# Altium schematic sheet S2_WirelessAudio_CC8530.SchDoc
size 431 x 279 mm; Revision: 1-0; SheetNumber: 3; SheetTotal: 4; CustomerName: PLASTIMOLD; .GlobalProjectCustomer: PLASTIMOLD; ProjectName: Chairspeaker TI Receiver
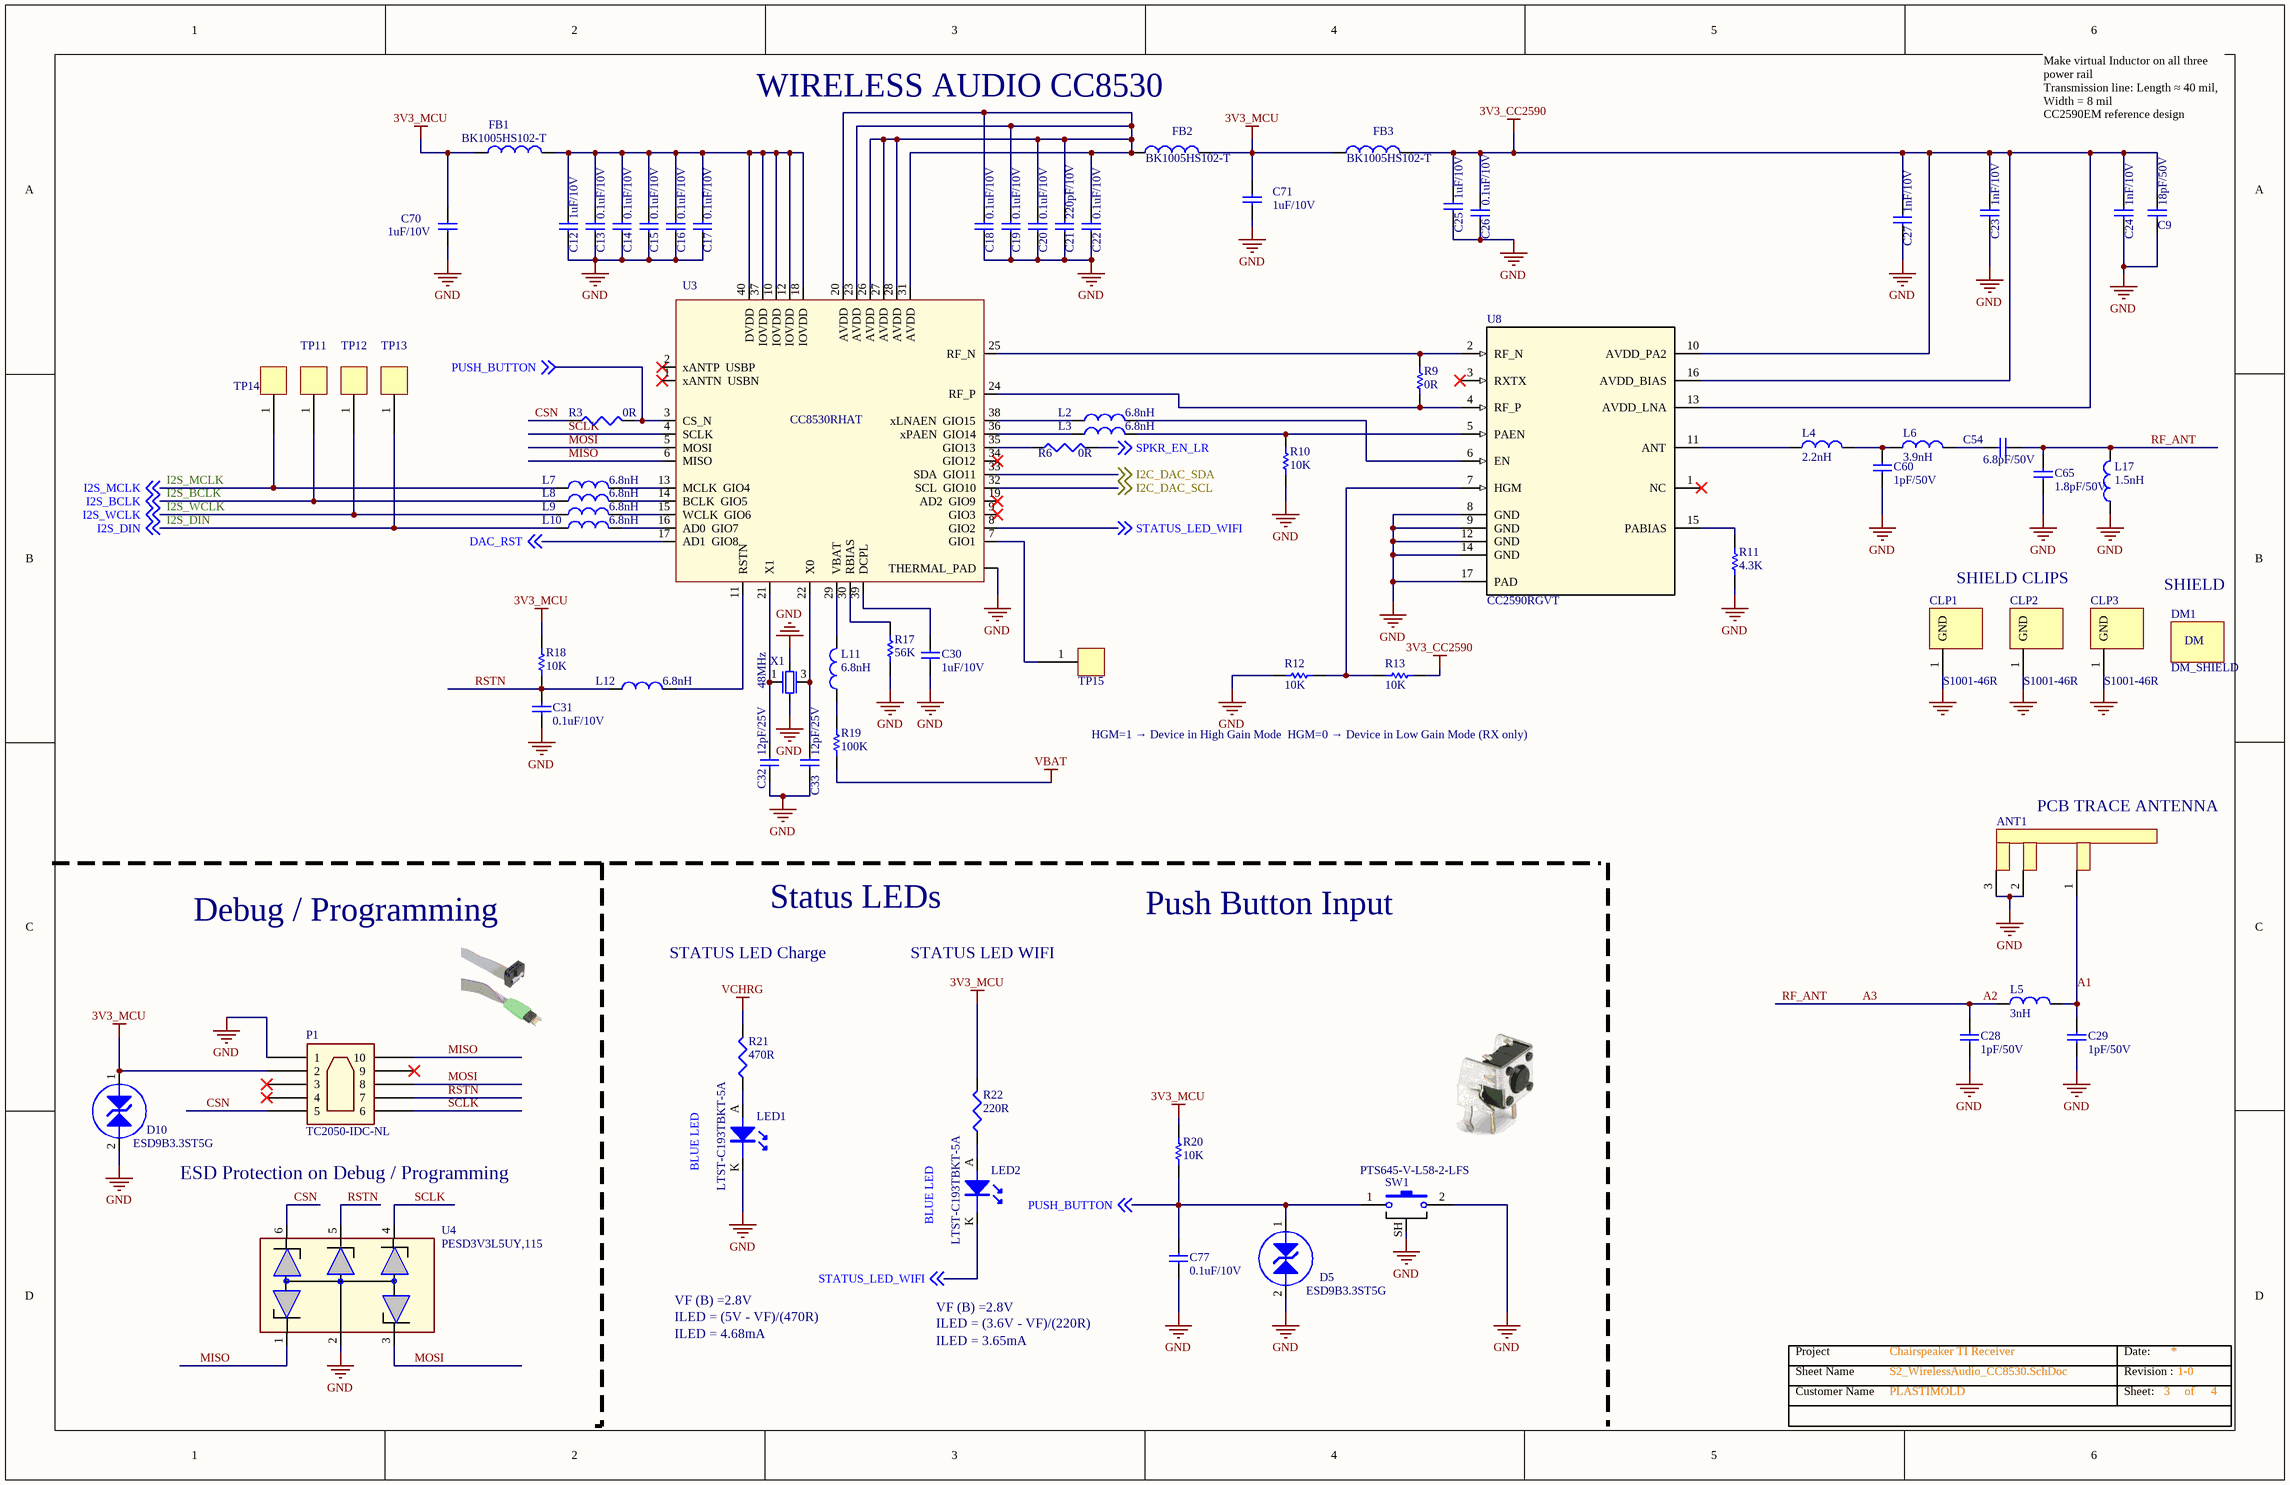
[diagram p0: S2_WirelessAudio_CC8530.SchDoc]

## Parts
ANT1  INVERTED F ANTENNA  [ANT]  (value not drawn)  (no BOM)
C9  18pF/50V  [CAP_0402_(M1005)]
C12  1uF/10V  [CAP_0402_(M1005)]
C13  0.1uF/10V  [CAP_0402_(M1005)]
C14  0.1uF/10V  [CAP_0402_(M1005)]
C15  0.1uF/10V  [CAP_0402_(M1005)]
C16  0.1uF/10V  [CAP_0402_(M1005)]
C17  0.1uF/10V  [CAP_0402_(M1005)]
C18  0.1uF/10V  [CAP_0402_(M1005)]
C19  0.1uF/10V  [CAP_0402_(M1005)]
C20  0.1uF/10V  [CAP_0402_(M1005)]
C21  220pF/10V  [CAP_0402_(M1005)]
C22  0.1uF/10V  [CAP_0402_(M1005)]
C23  1nF/10V  [CAP_0402_(M1005)]
C24  1nF/10V  [CAP_0402_(M1005)]
C25  1uF/10V  [CAP_0402_(M1005)]
C26  0.1uF/10V  [CAP_0402_(M1005)]
C27  1nF/10V  [CAP_0402_(M1005)]
C28  1pF/50V  [CAP_0402_(M1005)]
C29  1pF/50V  [CAP_0402_(M1005)]
C30  1uF/10V  [CAP_0402_(M1005)]
C31  0.1uF/10V  [CAP_0402_(M1005)]
C32  12pF/25V  [CAP_0402_(M1005)]
C33  12pF/25V  [CAP_0402_(M1005)]
C54  6.8pF/50V  [CAP_0402_(M1005)]
C60  1pF/50V  [CAP_0402_(M1005)]
C65  1.8pF/50V  [CAP_0402_(M1005)]
C70  1uF/10V  [CAP_0402_(M1005)]
C71  1uF/10V  [CAP_0402_(M1005)]
C77  0.1uF/10V  [CAP_0402_(M1005)]
CLP1  S1001-46R  [S1001-46R]
CLP2  S1001-46R  [S1001-46R]
CLP3  S1001-46R  [S1001-46R]
D5  ESD9B3.3ST5G  [SOD-923-BI-DIRECTIONAL]
D10  ESD9B3.3ST5G  [SOD-923-BI-DIRECTIONAL]
DM1  DM_SHIELD
FB1  BK1005HS102-T  [IND_0402_(M1005)]
FB2  BK1005HS102-T  [IND_0402_(M1005)]
FB3  BK1005HS102-T  [IND_0402_(M1005)]
L2  6.8nH  [IND_0402_(M1005)]
L3  6.8nH  [IND_0402_(M1005)]
L4  2.2nH  [IND_0402_(M1005)]
L5  3nH  [IND_0402_(M1005)]
L6  3.9nH  [IND_0402_(M1005)]
L7  6.8nH  [IND_0402_(M1005)]
L8  6.8nH  [IND_0402_(M1005)]
L9  6.8nH  [IND_0402_(M1005)]
L10  6.8nH  [IND_0402_(M1005)]
L11  6.8nH  [IND_0402_(M1005)]
L12  6.8nH  [IND_0402_(M1005)]
L17  1.5nH  [IND_0402_(M1005)]
LED1  LTST-C193TBKT-5A  [LED0603_TM]
LED2  LTST-C193TBKT-5A  [LED0603_TM]
P1  TC2050-IDC-NL  [TC2050-IDC-NL]
R3  0R  [RES_0402_(M1005)]
R6  0R  [RES_0402_(M1005)]
R9  0R  [RES_0402_(M1005)]
R10  10K  [RES_0402_(M1005)]
R11  4.3K  [RES_0402_(M1005)]
R12  10K  [RES_0402_(M1005)]
R13  10K  [RES_0402_(M1005)]
R17  56K  [IND_0402_(M1005)]
R18  10K  [RES_0402_(M1005)]
R19  100K  [RES_0402_(M1005)]
R20  10K  [RES_0402_(M1005)]
R21  470R  [RES_0402_(M1005)]
R22  220R  [RES_0402_(M1005)]
SW1  PTS645-V-L58-2-LFS  [SWITCH-PTS645-VL]
TP11  TP  [TestP SM 30MIL ROUND]  (value not drawn)  (no BOM)
TP12  TP  [TestP SM 30MIL ROUND]  (value not drawn)  (no BOM)
TP13  TP  [TestP SM 30MIL ROUND]  (value not drawn)  (no BOM)
TP14  TP  [TestP SM 30MIL ROUND]  (value not drawn)  (no BOM)
TP15  TP  [TestP SM 30MIL ROUND]  (value not drawn)  (no BOM)
U3  CC8530RHAT  [VFQFN40]
U4  PESD3V3L5UY,115  [SOT-363]
U8  CC2590RGVT  [QFN65P400X400X100-17N-D]
X1  48MHz  [ECX-2236B]

## Nets
3V3_CC2590: C9.2 C23.2 C24.2 C25.2 C26.2 C27.2 FB3.2 R13.2 U8.10(AVDD_PA2) U8.13(AVDD_LNA) U8.16(AVDD_BIAS)
3V3_MCU: C70.2 C71.2 D10.1 FB1.1 FB2.2 FB3.1 P1.2 R18.1 R20.1 R22.2
GND: ANT1.2 ANT1.3 C9.1 C12.1 C13.1 C14.1 C15.1 C16.1 C17.1 C18.1 C19.1 C20.1 C21.1 C22.1 C23.1 C24.1 C25.1 C26.1 C27.1 C28.2 C29.2 C30.1 C31.1 C32.2 C33.2 C60.2 C65.1 C70.1 C71.1 C77.2 CLP1.1(GND) CLP2.1(GND) CLP3.1(GND) D5.2 D10.2 L17.1 LED1.K P1.1 R10.2 R11.1 R12.1 R17.2 SW1.2 SW1.SH U3.GND(THERMAL_PAD) U4.2(GND) U8.8(GND) U8.9(GND) U8.12(GND) U8.14(GND) U8.17(PAD) X1.2 X1.4
VBAT: R19.2
VCHRG: R21.2
A1: ANT1.1 C29.1 L5.2
A2: C28.1 C54.2 C65.2 L5.1 L17.2  [also labelled A3, RF_ANT]
CSN: P1.5 R3.1 U4.6(I/O4)
DAC_RST: U3.17(AD1__GIO8) ; off-sheet DAC_RST
I2C_DAC_SCL: U3.32(SCL__GIO10) ; off-sheet I2C_DAC_SCL
I2C_DAC_SDA: U3.33(SDA__GIO11) ; off-sheet I2C_DAC_SDA
I2S_BCLK: L8.1 TP11.1 ; off-sheet I2S_BCLK
I2S_DIN: L10.1 TP13.1 ; off-sheet I2S_DIN
I2S_MCLK: L7.1 TP14.1 ; off-sheet I2S_MCLK
I2S_WCLK: L9.1 TP12.1 ; off-sheet I2S_WCLK
MISO: P1.10 U3.6(MISO) U4.1(I/O1)
MOSI: P1.8 U3.5(MOSI) U4.3(I/O2)
PUSH_BUTTON: C77.1 D5.1 R3.2 R20.2 SW1.1 U3.3(CS_N) ; off-sheet PUSH_BUTTON
RSTN: C31.2 L12.1 P1.7 R18.2 U4.5(VDD)
SCLK: P1.6 U3.4(SCLK) U4.4(I/O3)
SPKR_EN_LR: R6.2 ; off-sheet SPKR_EN_LR
STATUS_LED_WIFI: LED2.K U3.8(GIO2) ; off-sheet STATUS_LED_WIFI
NetC12_2: C12.2 C13.2 C14.2 C15.2 C16.2 C17.2 FB1.2 U3.10(IOVDD) U3.12(IOVDD) U3.18(IOVDD) U3.37(IOVDD) U3.40(DVDD)
NetC18_2: C18.2 C19.2 C20.2 C21.2 C22.2 FB2.1 U3.20(AVDD) U3.23(AVDD) U3.26(AVDD) U3.27(AVDD) U3.28(AVDD) U3.31(AVDD)
NetC30_2: C30.2 U3.39(DCPL)
NetC32_1: C32.1 U3.21(X1) X1.1
NetC33_1: C33.1 U3.22(X0) X1.3
NetC54_1: C54.1 L6.2
NetC60_1: C60.1 L4.2 L6.1
NetL2_1: L2.1 U3.38(xLNAEN__GIO15)
NetL2_2: L2.2 U8.6(EN)
NetL3_1: L3.1 U3.36(xPAEN__GIO14)
NetL3_2: L3.2 R10.1 U8.5(PAEN)
NetL4_1: L4.1 U8.11(ANT)
NetL7_2: L7.2 U3.13(MCLK__GIO4)
NetL8_2: L8.2 U3.14(BCLK__GIO5)
NetL9_2: L9.2 U3.15(WCLK__GIO6)
NetL10_2: L10.2 U3.16(AD0__GIO7)
NetL11_1: L11.1 R19.1
NetL11_2: L11.2 U3.29(VBAT)
NetL12_2: L12.2 U3.11(RSTN)
NetLED1_A: LED1.A R21.1
NetLED2_A: LED2.A R22.1
NetR6_1: R6.1 U3.35(GIO13)
NetR9_1: R9.1 U3.24(RF_P) U8.4(RF_P)
NetR9_2: R9.2 U3.25(RF_N) U8.2(RF_N)
NetR11_2: R11.2 U8.15(PABIAS)
NetR12_2: R12.2 R13.1 U8.7(HGM)
NetR17_1: R17.1 U3.30(RBIAS)
NetTP15_1: TP15.1 U3.7(GIO1)

Not connected (* = marked no-connect by the designer): P1 3* 4* 9*; U3 1(xANTN__USBN)* 2(xANTP__USBP)* 9(GIO3)* 19(AD2__GIO9)* 34(GIO12)*; U8 1(NC)* 3(RXTX)*

## Notes on the sheet
- WIRELESS AUDIO CC8530
- Make virtual Inductor on all three power rail
  Transmission line: Length ≈ 40 mil, Width = 8 mil
  CC2590EM reference design
- SHIELD CLIPS
- SHIELD
- HGM=1 → Device in High Gain Mode  HGM=0 → Device in Low Gain Mode (RX only)
- PCB TRACE ANTENNA
- Debug / Programming
- STATUS LED Charge
- Status LEDs
- STATUS LED WIFI
- Push Button Input
- BLUE LED
- ESD Protection on Debug / Programming
- VF (B) =2.8V
- ILED = 4.68mA
- ILED = (5V - VF)/(470R)
- ILED = 3.65mA
- ILED = (3.6V - VF)/(220R)
- Sheet Name
- Project
- Date:
- Revision :
- Customer Name
- Sheet:
- of
- (in symbol DM_SHIELD) DM

## Library data of the parts
ANT1 = INVERTED_F: =Description1; Manufacturer 1: NA; Cross Allowed: NO; Description1: Inverted F Antenna; Value: Inverted F Antenna; Manufacturer Part Number 1: NA
C9 = CAP: =Description1; Manufacturer 1: Samsung Electro-Mechanics; Manufacturer Part Number 1: CL05C180JB5NNNC; Description1: CAP CER 18PF 50V C0G/NP0 0402; Cross Allowed: YES; Value: 18pF/50V
C12 C25 C30 C70 C71 = CAP: =Description1; Manufacturer 1: Murata Electronics; Manufacturer Part Number 1: GRM155R61A105KE15D; Description1: CAP CER 1UF 10V X5R 0402; Cross Allowed: YES; Value: 1uF/10V
C13-C20 C22 C26 C31 C77 = CAP_1: =Description1; Manufacturer 1: Yageo; Manufacturer Part Number 1: CC0402KRX7R6BB104; Description1: CAP CER 0.1UF 10V X7R 0402; Cross Allowed: YES; Value: 0.1uF/10V
C21 = CAP_1: =Description1; Manufacturer 1: Würth Elektronik; Manufacturer Part Number 1: 885012005015; Description1: CAP CER 220PF 10V C0G/NP0 0402; Cross Allowed: YES; Value: 220pF/10V
C23 C24 C27 = CAP_1: =Description1; Manufacturer 1: Yageo; Manufacturer Part Number 1: CC0402KRX7R6BB103; Description1: CAP CER 10000PF 10V X7R 0402; Cross Allowed: YES; Value: 1nF/10V
C28 C29 C60 = CAP: =Description1; Manufacturer 1: AVX Corporation; Manufacturer Part Number 1: 04025A1R0KAT2A; Description1: CAP CER 1PF 50V NP0 0402; Cross Allowed: YES; Value: 1pF/50V
C32 C33 = CAP_1: =Description1; Manufacturer 1: Walsin Technology Corporation; Manufacturer Part Number 1: 0402N120J250CT; Description1: CAP CER 12PF 25V C0G/NP0 0402; Cross Allowed: YES; Value: 12pF/25V
C54 = CAP: =Description1; Manufacturer 1: Samsung Electro-Mechanics; Manufacturer Part Number 1: 04025A6R8KAT2A; Description1: CAP CER 6.8PF 50V C0G/NP0 0402; Cross Allowed: YES; Value: 6.8pF/50V
C65 = CAP: =Description1; Manufacturer 1: Samsung Electro-Mechanics; Manufacturer Part Number 1: CL05C1R8BB5NNNC; Description1: CAP CER 1.8PF 50V C0G/NP0 0402; Cross Allowed: YES; Value: 1.8pF/50V
CLP1-CLP3 = S2711-46R: =Description1; Manufacturer 1: Harwin Inc.; Description1: RFI SHIELD CLIP MICRO TIN SMD; Cross Allowed: NO; Manufacturer Part Number 1: S1001-46R; Value: S1001-46R
D5 D10 = TVS-DIODE: TVS DIODE 5V 15.5V 0402; Manufacturer 1: ON Semiconductor; Description1: TVS DIODE 3.3V 11.5V SOD923; Cross Allowed: YES; Manufacturer Part Number 1: ESD9B3.3ST5G; VALUE: ESD9B3.3ST5G
DM1 = DM_SHIELD: =Description1; Description1: TBD; Value: DM-SHIELD; Cross Allowed: NO; Manufacturer 1: TBD; Manufacturer Part Number 1: TBD
FB1-FB3 = FERRITE BEAD: =Description1; Manufacturer 1: Taiyo Yuden; Description1: FERRITE BEAD 1 KOHM 0402 1LN; Cross Allowed: YES; Manufacturer Part Number 1: BK1005HS102-T; Value: BK1005HS102-T
L2 L3 L7-L12 = IND: =Description1; Manufacturer Part Number 1: HK10056N8J-T; Manufacturer 1: Taiyo Yuden; Description1: FIXED IND 6.8NH 430MA 250 MOHM; Cross Allowed: YES; Value: 6.8nH
L4 = IND: =Description1; Manufacturer Part Number 1: LQG15HS2N2S02D; Manufacturer 1: Murata Electronics; Description1: FIXED IND 2.2NH 900MA 120MOHM SM; Cross Allowed: YES; Value: 2.2nH
L5 = IND: =Description1; Manufacturer Part Number 1: LQG15HS3N0S02D; Manufacturer 1: Murata Electronics; Description1: FIXED IND 3NH 800MA 125 MOHM SMD; Cross Allowed: YES; Value: 3nH
L6 = IND: =Description1; Manufacturer Part Number 1: LQG15HS3N9S02D; Manufacturer 1: Murata Electronics; Description1: FIXED IND 3.9NH 750MA 180MOHM SM; Cross Allowed: YES; Value: 3.9nH
L17 = IND: =Description1; Manufacturer Part Number 1: LQG15HS1N5S02D; Manufacturer 1: Murata Electronics; Description1: FIXED IND 1.5NH 1A 100 MOHM SMD; Cross Allowed: YES; Value: 1.5nH
LED1 LED2 = LED: LED GREEN 0603 SMD; Manufacturer 1: LITEON; Description1: LED BLUE CLEAR CHIP 0603 SMD; Cross Allowed: YES; Manufacturer Part Number 1: LTST-C193TBKT-5A; VALUE: LTST-C193TBKT-5A
P1 = TC2050-IDC: =Description1; Manufacturer 1: TAG-CONNECT; Description1: PROGRAMMING CABLE PLUG-OF-NAILS; Cross Allowed: NO; Manufacturer Part Number 1: TC2050-IDC-NL; VALUE: TC2050-IDC-NL
R3 R6 = RES_0R: =Description1; Manufacturer 1: Panasonic Electronic Components; Manufacturer Part Number 1: ERJ-2GE0R00X; Description1: RES 0R JUMPER 1/10W 0402; Cross Allowed: YES; Value: 0R
R9 = RC1206JR-070RL: =Description1; Manufacturer 1: Panasonic Electronic Components; Manufacturer Part Number 1: ERJ-2GE0R00X; Description1: RES 0R JUMPER 1/10W 0402; Cross Allowed: YES; Value: 0R
R10 R12 R13 R18 R20 = RESISTOR: =Description1; Manufacturer 1: Stackpole Electronics Inc; Manufacturer Part Number 1: RMCF0402FT10K0; Description1: RES 10K OHM 1% 1/16W 0402; Cross Allowed: YES; Value: 10K
R11 = RESISTOR: =Description1; Manufacturer 1: KOA Speer Electronics, Inc.; Manufacturer Part Number 1: RK73H1ETTP4301F; Description1: RES 4.3K OHM 1% 1/10W 0402; Cross Allowed: YES; Value: 4.3K
R17 = RC1206JR-070RL: =Description1; Manufacturer 1: Stackpole Electronics Inc; Manufacturer Part Number 1: RMCF0402FT56K0; Description1: RES 56K OHM 1% 1/16W 0402; Cross Allowed: YES; Value: 56K
R19 = RC1206JR-070RL: =Description1; Manufacturer 1: Stackpole Electronics Inc; Manufacturer Part Number 1: RMCF0402FT100K; Description1: RES 100K OHM 1% 1/16W 0402; Cross Allowed: YES; Value: 100K
R21 = RES: RES 470 OHM 1% 1/16W 0402; Manufacturer 1: Stackpole Electronics Inc; Manufacturer Part Number 1: RMCF0402FT470R; Cross Allowed: YES; Description1: RES 470 OHM 1% 1/16W 0402; VALUE: 470R
R22 = RES: RES 220 OHM 1% 1/16W 0402; Manufacturer 1: Stackpole Electronics Inc; Manufacturer Part Number 1: RMCF0402FT220R; Cross Allowed: YES; Description1: RES 220 OHM 1% 1/16W 0402; VALUE: 220R
SW1 = PB_SWITCH: SWITCH TACTILE SPST-NO 0.05A 12V; Manufacturer1: C&K; Cross Allowed: YES; Description1: SWITCH TACTILE SPST-NO 0.05A 12V; Manufacturer Part Number 1: PTS645-V-L58-2-LFS; Value: PTS645-V-L58-2-LFS; Manufacturer 1: C&K
TP11-TP15 = TP: =Description1; Description1: NA; Value: NA; Cross Allowed: YES; Manufacturer 1: NA; Manufacturer Part Number 1: NA
U3 = CC5820: =Description1; Manufacturer 1: Texas Instruments; Description1: RF Transceiver PurePath Wireless 2.4GHz RF SoC; Cross Allowed: NO; Manufacturer Part Number 1: CC8530RHAT; Value: CC8530RHAT
U4 = PESD3V3L5UY,115: =Description1; Manufacturer 1: Nexperia USA Inc.; Description1: TVS DIODE 3.3V 12V 6TSSOP; Cross Allowed: NO; Manufacturer Part Number 1: PESD3V3L5UY,115; Value: PESD3V3L5UY,115
U8 = CC2590RGVT: No Description Available; PartNumber: CC2590RGVR; Manufacturer: Texas Instruments; Description1: IC RF FRONT END 2.4GHZ 16-QFN; RefDes: RefDes; Type: DEV; Value: Value; Copyright: Copyright (C) 2021 Accelerated Designs. All rights reserved
X1 = CRYSTAL_4PIN: =Description1; Manufacturer 1: ECS Inc.; Manufacturer Part Number 1: ECS-480-10-36B-CKM-TR; Description1: CRYSTAL 48.0000MHZ 10PF SMD; Cross Allowed: NO; Value: 48MHz